# Altium schematic sheet [01] - COVER PAGE.SchDoc
size A3; DocumentNumber: 1; SheetNumber: 1; SheetTotal: 20
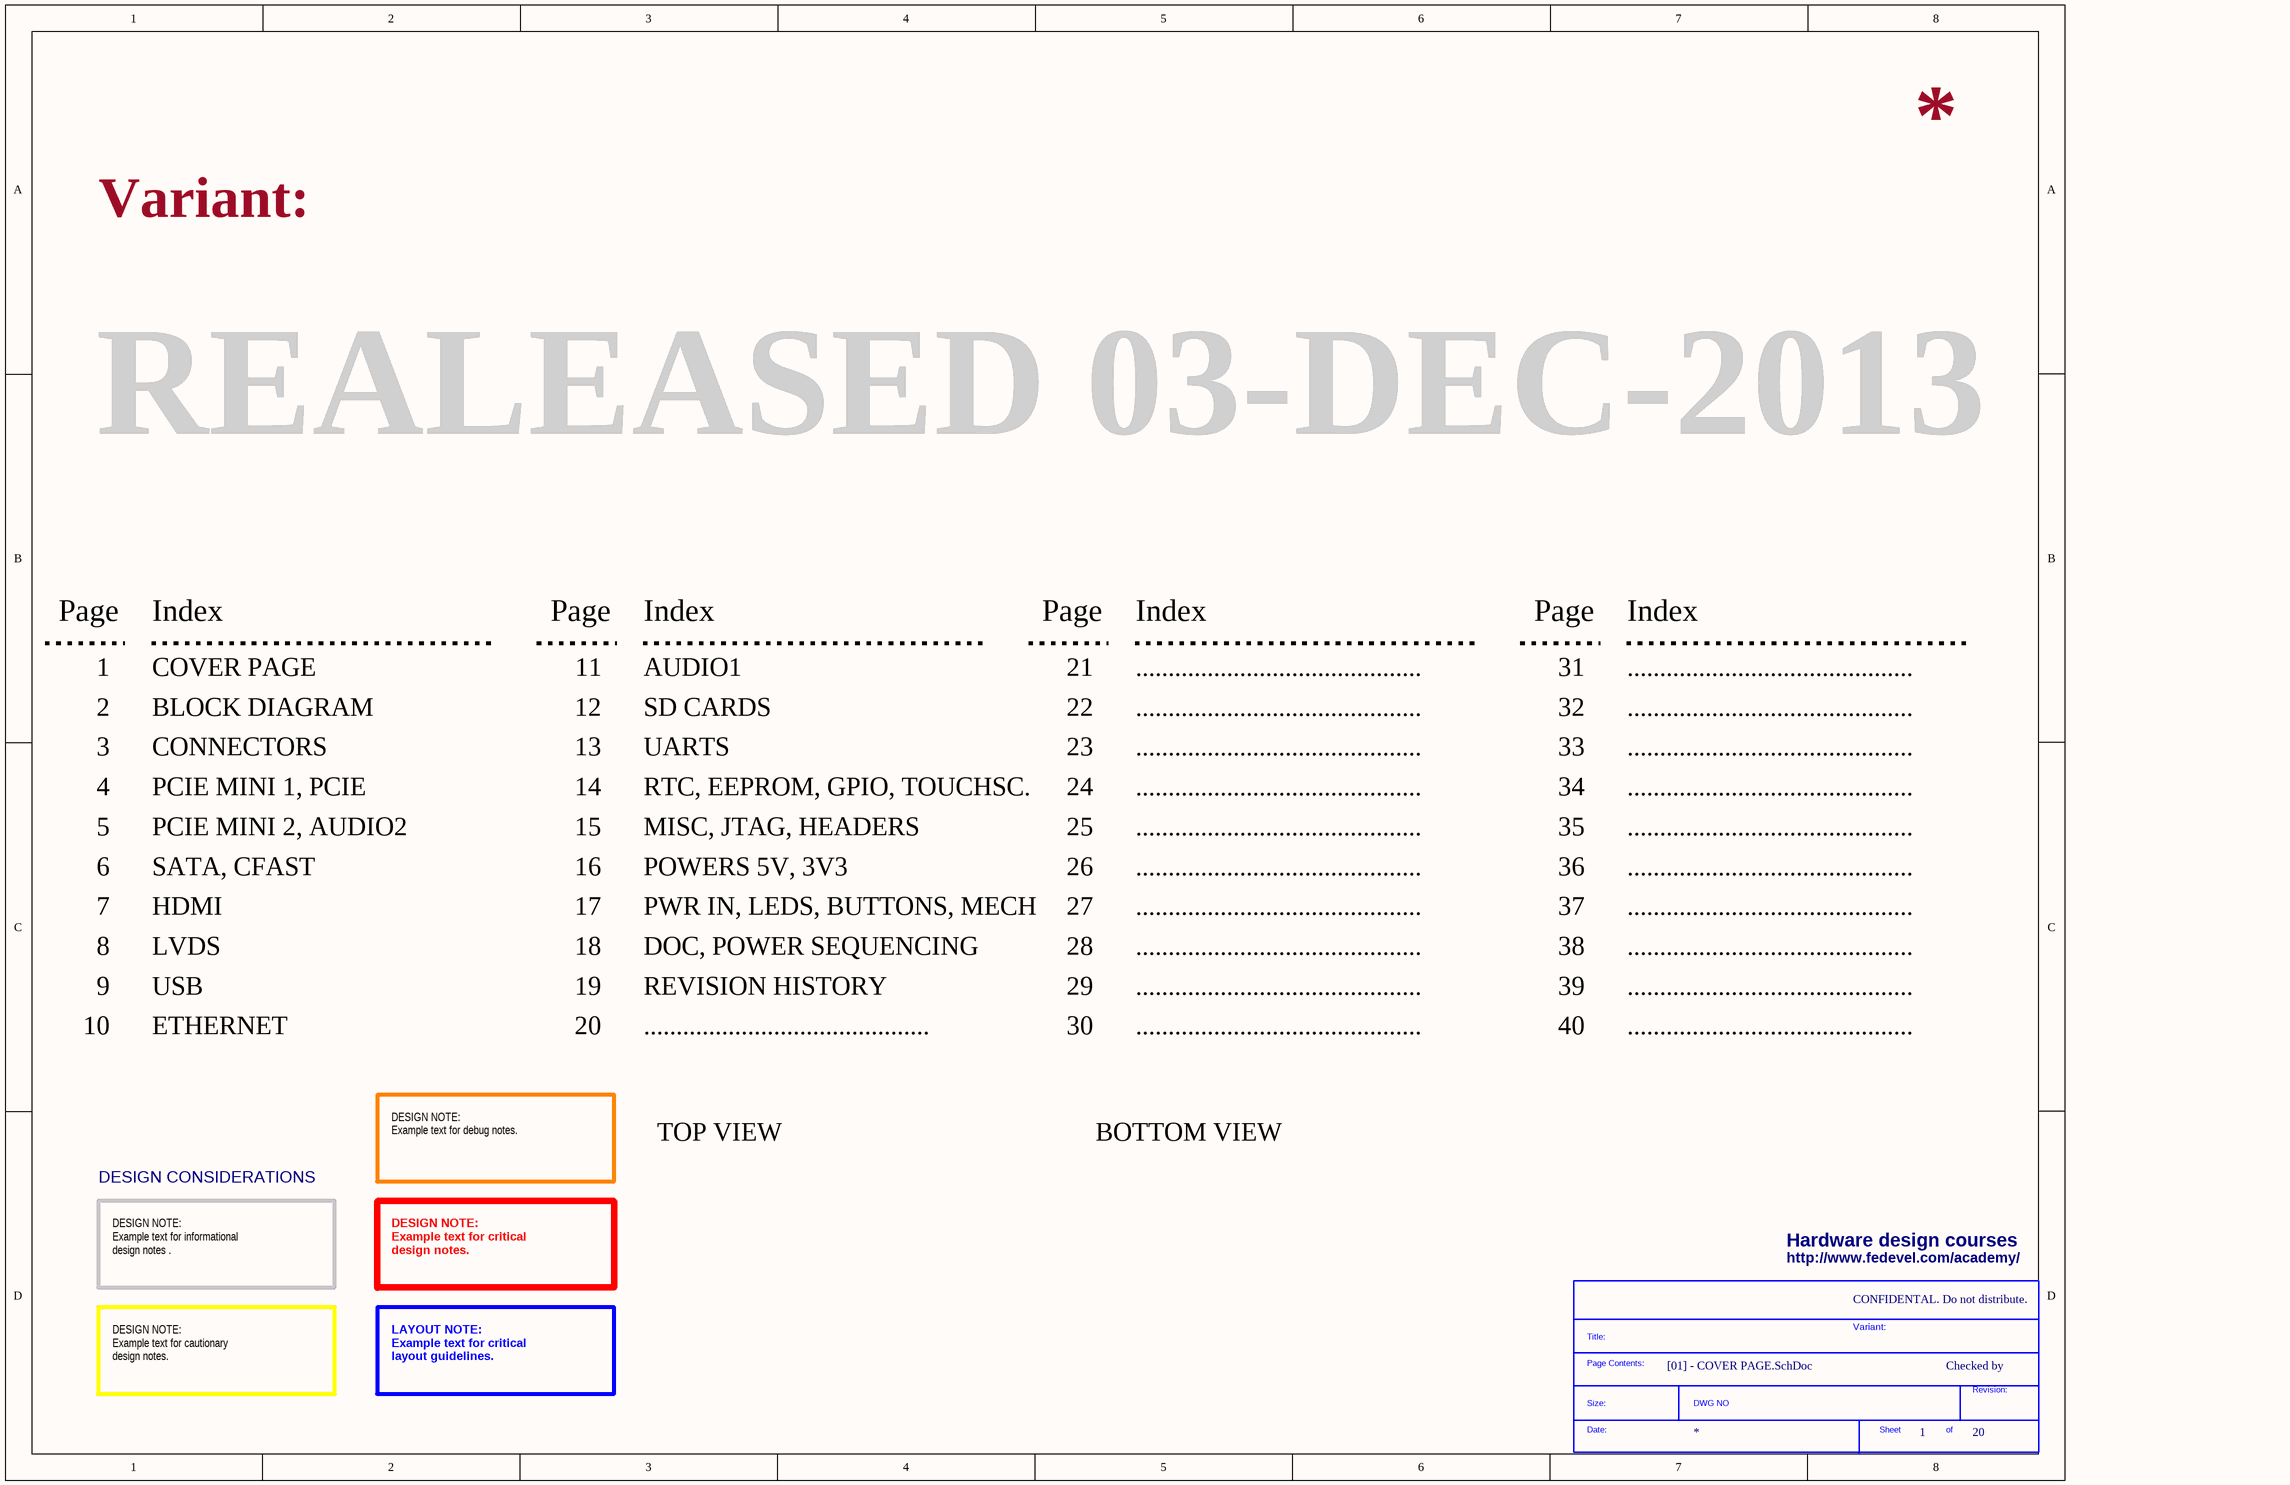
[diagram p0: [01] - COVER PAGE.SchDoc]

## Parts
*  SDTitleBlock  (value not drawn)  (graphical)

## Notes on the sheet
- Variant:
- REALEASED 03-DEC-2013
- Page
- Index
- 1
- COVER PAGE
- 11
- AUDIO1
- 21
- ............................................
- 31
- 2
- 3
- BLOCK DIAGRAM
- CONNECTORS
- 12
- 13
- SD CARDS
- UARTS
- 22
- 23
- 32
- 33
- 4
- 5
- PCIE MINI 1, PCIE
- PCIE MINI 2, AUDIO2
- 14
- 15
- RTC, EEPROM, GPIO, TOUCHSC.
- MISC, JTAG, HEADERS
- 24
- 25
- 34
- 35
- 6
- SATA, CFAST
- 16
- POWERS 5V, 3V3
- 26
- 36
- 7
- 8
- HDMI
- LVDS
- 17
- 18
- PWR IN, LEDS, BUTTONS, MECH
- DOC, POWER SEQUENCING
- 27
- 28
- 37
- 38
- 9
- 10
- USB
- ETHERNET
- 19
- 20
- REVISION HISTORY
- 29
- 30
- 39
- 40
- DESIGN NOTE:
  Example text for debug notes.
- TOP VIEW
- BOTTOM VIEW
- DESIGN CONSIDERATIONS
- Hardware design courses
- DESIGN NOTE:
  Example text for informational
  design notes .
- DESIGN NOTE:
  Example text for critical
  design notes.
- http://www.fedevel.com/academy/
- CONFIDENTAL. Do not distribute.
- Checked by
- DESIGN NOTE:
  Example text for cautionary
  design notes.
- LAYOUT NOTE:
  Example text for critical
  layout guidelines.
- (in symbol SDTitleBlock) Title:; Page Contents:; Revision:; Size:; DWG NO; Date:; Sheet; of